# Altium schematic sheet Master MicroController Serial Communication Port.SchDoc: Master MicroController Communication Port Pin Out
size 292 x 193 mm; DocumentNumber: 27; SheetNumber: 21; SheetTotal: 50
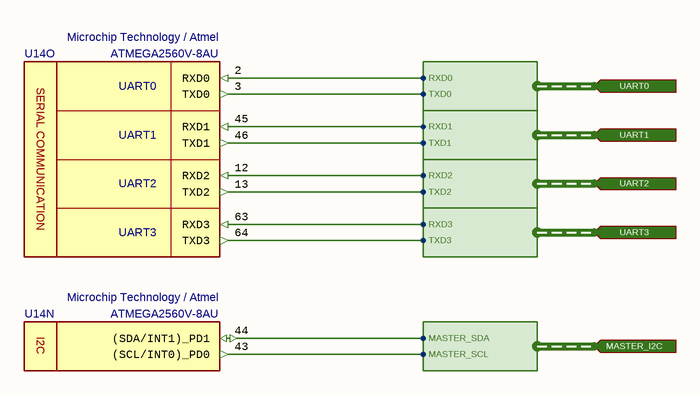
[diagram p0: Master MicroController Serial Communication Port.SchDoc]

## Parts
U14  Manufacturer_Part_Number: ATMEGA2560V-8AU  Manufacturer_Name: Microchip Technology / Atmel  [TQFP100]  (hidden comment: 8-bit MicroController)  (parts N,O of 15)

## Ports
MASTER_I2C (in, harness MASTER_I2C), UART0 (in, harness UART0), UART1 (in, harness UART1), UART2 (in, harness UART2), UART3 (in, harness UART3)

## Harnesses
UART0: RXD0, TXD0
UART1: RXD1, TXD1
UART2: RXD2, TXD2
UART3: RXD3, TXD3
MASTER_I2C: MASTER_SDA, MASTER_SCL

## Nets
NetU14_2: U14.2(RXD0) ; port UART0.RXD0
NetU14_3: U14.3(TXD0) ; port UART0.TXD0
NetU14_12: U14.12(RXD2) ; port UART2.RXD2
NetU14_13: U14.13(TXD2) ; port UART2.TXD2
NetU14_43: U14.43((SCL/INT0)_PD0) ; port MASTER_I2C.MASTER_SCL
NetU14_44: U14.44((SDA/INT1)_PD1) ; port MASTER_I2C.MASTER_SDA
NetU14_45: U14.45(RXD1) ; port UART1.RXD1
NetU14_46: U14.46(TXD1) ; port UART1.TXD1
NetU14_63: U14.63(RXD3) ; port UART3.RXD3
NetU14_64: U14.64(TXD3) ; port UART3.TXD3

## Notes on the sheet
- © 2021 All rights reserved.
  This document may not, in whole or in part, be copied, photocopied, reproduced, translated or converted to any electronic or machine readable from without prior written permission of Mehmet Günce Akkoyun.
  Engineer contact : akkoyun@me.com
- Property of
- Engineer :
- Date :
- Size :
- A4
- Time :
- Project :
- Page :
- /
- Customer :
- Product ID :
- Module ID :
- Version :
- File :
- Revision :
- (in symbol IC - ATMEGA2560V-8AU, part N) I2C
- (in symbol IC - ATMEGA2560V-8AU, part O) UART0; UART1; SERIAL COMMUNICATION; UART2; UART3

## Library data of the parts
U14 = IC - ATMEGA2560V-8AU: 8-bit Microcontrollers - MCU 256kB Flash 4kB EEPROM 86 I/O Pins; Supply Voltage - Min: 2V7; Supply Voltage - Max: 5.5V; Height: 1mm; Mouser_Part_Number: 556-ATMEGA2560V8AU; ComponentLink1Description: DataSheet; ComponentLink1URL: https://eu.mouser.com/datasheet/2/268/Atmel-2549-8-bit-AVR-Microcontroller-ATmega640-128-1315286.pdf; ROHS: Yes; Minimum Operating Temperature: -40; Maximum Operating Temperature: +85; ComponentLink2Description: Mouser; ComponentLink2URL: https://eu.mouser.com/ProductDetail/Microchip-Technology-Atmel/ATMEGA2560V-8AU?qs=sGAEpiMZZMutXGli8Ay4kKlCYcvZUWqJYdtgGFyqFT8%3D; Supplier 1: Mouser; Supplier 2: Arrow; Supplier 3: Farnell; Supplier 4: Newark; Supplier 5: Digi-Key; Supplier Part Number 1: 556-ATMEGA2560V8AU; Supplier Part Number 2: ATMEGA2560V-8AU; Supplier Part Number 3: 1288331; Supplier Part Number 4: 68T2784; Supplier Part Number 5: ATMEGA2560V-8AU-ND; Case: TQFP-100